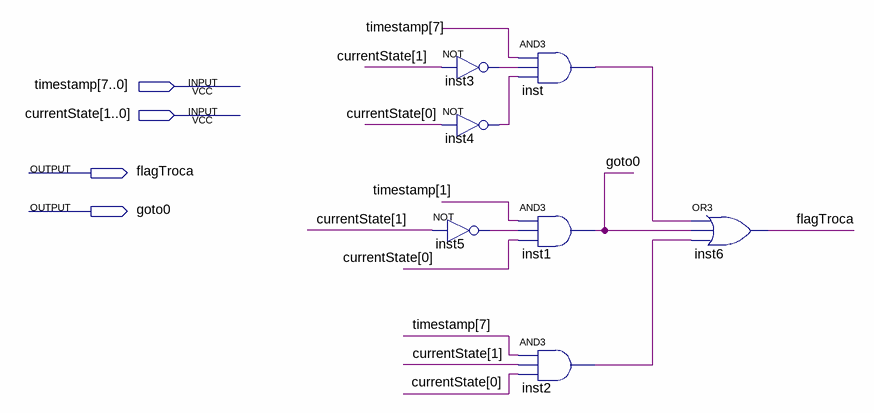
[diagram p0: schematic sheet]
// Quartus schematic CounterLogic.bdf as structural Verilog: 7 symbols, 4 pins
module CounterLogic (
  input  [7:0] timestamp,
  input  [1:0] currentState,
  output flagTroca,
  output goto0
);

  wire inst2_out, inst3_out, inst4_out, inst5_out, inst_out;

  not inst3 (inst3_out, currentState[1]);
  not inst4 (inst4_out, currentState[0]);
  not inst5 (inst5_out, currentState[1]);
  and inst (inst_out, timestamp[7], inst3_out, inst4_out);
  and inst1 (goto0, timestamp[1], inst5_out, currentState[0]);
  and inst2 (inst2_out, timestamp[7], currentState[1], currentState[0]);
  or inst6 (flagTroca, inst_out, goto0, inst2_out);
endmodule
